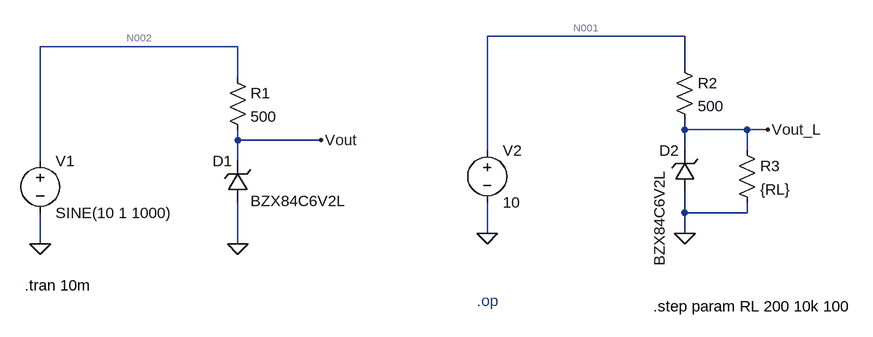
[diagram p0: schematic Lab2Part2.asc]
Lab2Part2.asc, the LTspice schematic file:
Version 4
SHEET 1 1340 680
WIRE 1056 0 752 0
WIRE 368 16 64 16
WIRE 1056 48 1056 0
WIRE 368 64 368 16
WIRE 1056 144 1056 128
WIRE 1152 144 1056 144
WIRE 1184 144 1152 144
WIRE 368 160 368 144
WIRE 496 160 368 160
WIRE 752 176 752 0
WIRE 1056 176 1056 144
WIRE 1152 176 1152 144
WIRE 64 192 64 16
WIRE 368 192 368 160
WIRE 1056 272 1056 240
WIRE 1152 272 1152 256
WIRE 1152 272 1056 272
WIRE 752 304 752 256
WIRE 1056 304 1056 272
WIRE 64 320 64 272
WIRE 368 320 368 256
FLAG 64 320 0
FLAG 368 320 0
FLAG 496 160 Vout
FLAG 752 304 0
FLAG 1056 304 0
FLAG 1184 144 Vout_L
SYMBOL voltage 64 176 R0
WINDOW 123 0 0 Left 0
WINDOW 39 0 0 Left 0
SYMATTR InstName V1
SYMATTR Value SINE(10 1 1000)
SYMBOL res 352 48 R0
SYMATTR InstName R1
SYMATTR Value 500
SYMBOL zener 384 256 R180
WINDOW 0 24 64 Left 2
WINDOW 3 -151 2 Left 2
SYMATTR InstName D1
SYMATTR Value BZX84C6V2L
SYMATTR Description Diode
SYMATTR Type diode
SYMBOL voltage 752 160 R0
WINDOW 123 0 0 Left 0
WINDOW 39 0 0 Left 0
SYMATTR InstName V2
SYMATTR Value 10
SYMBOL res 1040 32 R0
SYMATTR InstName R2
SYMATTR Value 500
SYMBOL zener 1072 240 R180
WINDOW 0 24 64 Left 2
WINDOW 3 55 -114 VRight 2
SYMATTR InstName D2
SYMATTR Value BZX84C6V2L
SYMATTR Description Diode
SYMATTR Type diode
SYMBOL res 1136 160 R0
SYMATTR InstName R3
SYMATTR Value {RL}
TEXT 1008 416 Left 2 !.step param RL 200 10k 100
TEXT 736 408 Left 2 ;.op
TEXT 40 384 Left 2 !.tran 10m

The netlist it stands for:
* Lab2Part2.asc
V1 N002 0 SINE(10 1 1000)
R1 N002 Vout 500
D1 0 Vout BZX84C6V2L
V2 N001 0 10
R2 N001 Vout_L 500
D2 0 Vout_L BZX84C6V2L
R3 Vout_L 0 {RL}
.model D D
.lib standard.dio
.step param RL 200 10k 100
* .op
.tran 10m
.backanno
.end

* Results of the author's LTspice run, read from the files saved beside the schematic
* Operating Point (first step), zero values left out:
*   rl = 200 
*   V(n002) = 10 V
*   V(vout) = 6.358 V
*   V(n001) = 10 V
*   V(vout_l) = 2.857 V
*   I(D1) = -7.285 mA
*   I(D2) = -1.503 nA
*   I(R1) = 7.285 mA
*   I(R2) = 14.29 mA
*   I(R3) = 14.29 mA
*   I(V1) = -7.285 mA
*   I(V2) = -14.29 mA
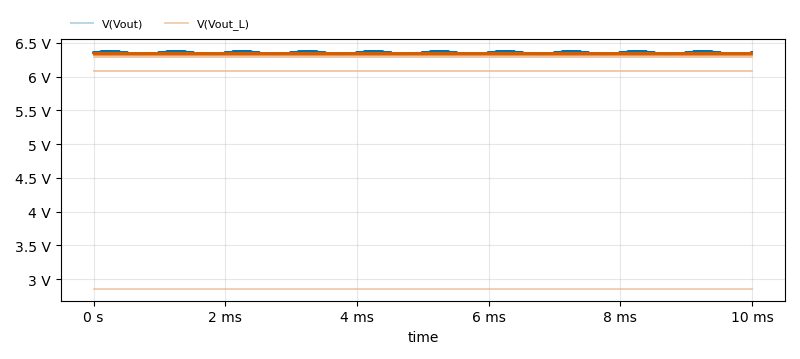
[diagram p1: Transient Analysis of Lab2Part2.asc, plotted from the saved traces]
* Transient Analysis, 99 runs:
*   V(Vout) [run 1]: min 6.333 V, max 6.377 V, average 6.356 V, rms 6.356 V, last 6.358 V
*   V(Vout) [run 2]: min 6.333 V, max 6.377 V, average 6.356 V, rms 6.356 V, last 6.358 V
*   V(Vout) [run 3]: min 6.333 V, max 6.377 V, average 6.356 V, rms 6.356 V, last 6.358 V
*   V(Vout) [run 4]: min 6.333 V, max 6.377 V, average 6.356 V, rms 6.356 V, last 6.358 V
*   V(Vout) [run 5]: min 6.333 V, max 6.377 V, average 6.356 V, rms 6.356 V, last 6.358 V
*   V(Vout) [run 6]: min 6.333 V, max 6.377 V, average 6.356 V, rms 6.356 V, last 6.358 V
*   V(Vout) [run 7]: min 6.333 V, max 6.377 V, average 6.356 V, rms 6.356 V, last 6.358 V
*   V(Vout) [run 8]: min 6.333 V, max 6.377 V, average 6.356 V, rms 6.356 V, last 6.358 V
*   V(Vout_L) [run 1]: min 2.857 V, max 2.857 V, average 2.857 V, rms 2.857 V, last 2.857 V
*   V(Vout_L) [run 2]: min 6.084 V, max 6.084 V, average 6.084 V, rms 6.084 V, last 6.084 V
*   V(Vout_L) [run 3]: min 6.292 V, max 6.292 V, average 6.292 V, rms 6.292 V, last 6.292 V
*   V(Vout_L) [run 4]: min 6.316 V, max 6.316 V, average 6.316 V, rms 6.316 V, last 6.316 V
*   V(Vout_L) [run 5]: min 6.329 V, max 6.329 V, average 6.329 V, rms 6.329 V, last 6.329 V
*   V(Vout_L) [run 6]: min 6.335 V, max 6.335 V, average 6.335 V, rms 6.335 V, last 6.335 V
*   V(Vout_L) [run 7]: min 6.339 V, max 6.339 V, average 6.339 V, rms 6.339 V, last 6.339 V
*   V(Vout_L) [run 8]: min 6.342 V, max 6.342 V, average 6.342 V, rms 6.342 V, last 6.342 V